# Altium schematic sheet BufferOut.SchDoc: Monitor Outputs Amplification and Buffering
size A; DrawnBy: Enrique Morell; DocumentNumber: 7; Revision: v0.1; SheetNumber: 7; SheetTotal: 9
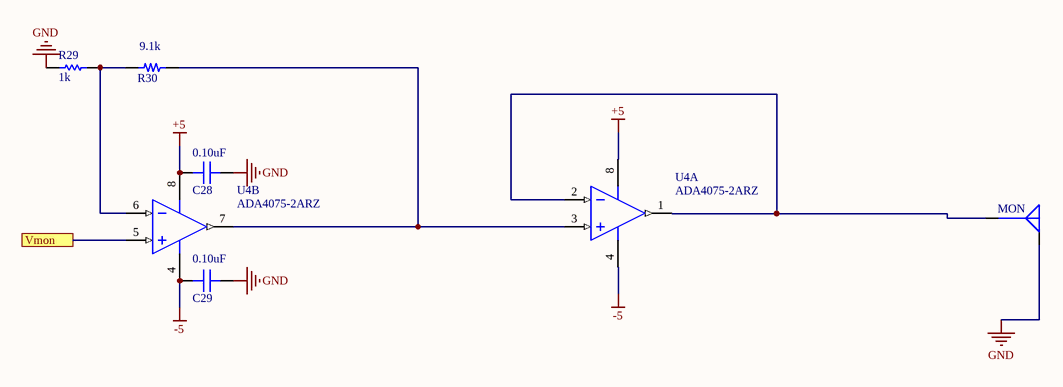
[diagram p0: BufferOut.SchDoc]

## Parts
C28  0.10uF  [CAP 0402/1005]
C29  0.10uF  [CAP 0402/1005]
MON  0731000114  [MOLEX SD-73100-0114]  (value not drawn)
R29  1k  [RESC1005X40X25NL05T05]
R30  9.1k  [RES 0402/1005]
U4  ADA4075-2ARZ  [ADI-R-8_N]  (parts A,B of 2)

## Ports
Vmon

## Nets
+5: C28.2 U4.8(+V)
-5: C29.2 U4.4(-V)
GND: C28.1 C29.1 MON.G R29.1
Vmon: U4.5(+IN_B) ; port Vmon
NetMON_S: MON.S U4.1(OUT_A) U4.2(-IN_A)
NetR29_2: R29.2 R30.1 U4.6(-IN_B)
NetR30_2: R30.2 U4.3(+IN_A) U4.7(OUT_B)

## Library data of the parts
C28 C29 = GRM155R71C104JA88D: CAP CER 0.1UF 16V X7R 0402; Manufacturer: Murata Electronics North America; TemperatureRange: -55C ~ 125C; Tolerance: 5%; Value: 0.10uF; Part Number: GRM155R71C104JA88D; PartId: 12366; Supplier 1: Digi-Key; Supplier Part Number 1: 490-6327-2-ND; ComponentLink1Description: Datasheet; ComponentLink1URL: http://www.murata.com/~/media/webrenewal/support/library/catalog/products/capacitor/mlcc/c02e.pdf; ComponentLink2Description: Digi-Key Listing; ComponentLink2URL: https://www.digikey.com/product-detail/en/murata-electronics-north-america/GRM155R71C104JA88D/490-6327-2-ND/2610891; TemperatureCoefficient: X7R; Voltage: 16V; Price: 0.0046; Device Package: 0402 (1005 Metric)
MON = 0731000114: CONN SMA RCPT R/A 50 OHM PCB; Manufacturer: Molex; Impedance: 50 Ohm; Body Finish: Gold; Body Material: Brass; Contact Termination: Solder; Dielectric Material: Polytetrafluoroethylene (PTFE); Voltage Rating: 500V; Center Contact Material: Gold; Center Contact Plating: Gold; ComponentLink1Description: Datasheet; ComponentLink1URL: https://www.molex.com/pdm_docs/sd/731000114_sd.pdf; ComponentLink2Description: Digi-Key Listing; ComponentLink2URL: https://www.digikey.com/product-detail/en/molex/0731000114/WM5525-ND/1465147; Fastening Type: Threaded; Housing Colour: Gold; Mounting Type: Through Hole, Right Angle; Operating Temperature: -65°C ~ 165°C; PartId: 16436; Part Number: 0731000114; Price: 5.14; Series: 73100; Shield Termination: Solder; Style: SMA; Supplier 1: Digi-Key; Supplier Part Number 1: WM5525-ND; Type: Receptacle, Female Socket
R29 = CMP-2002-00606-3: Chip Resistor, 1 KOhm, +/- 1%, 100 mW, -55 to 155 degC, 0402 (1005 Metric), RoHS, Tape and Reel; PartNumber: ERJ-2RKF1001X; Manufacturer: Basic Passives; Voltage Rating: 50 V; Case\/Package: 0402; Resistance: 1 KOhm; Power Rating: 100 mW; DatasheetVersion: 04/2015; Radiation Hardening: No; Pins: 2; Height: 0.35 mm; RoHSCompliant: true; Case Code (Imperial): 0402; ComponentLink2Description: Datasheet; ComponentLink1Description: Manufacturer URL; PackageReference: 0402; Mount: Surface Mount; Package Quantity: 10000; Tolerance: 1%; ComponentLink1URL: http://www.panasonic.com/; PackageDescription: 2-Pin Surface Mount Device, Body 1 x 0.5 mm; Mounting Technology: Surface Mount; Case Code (Metric): 1005; ComponentLink2URL: http://industrial.panasonic.com/cdbs/www-data/pdf/RDA0000/AOA0000C86.pdf; REACH SVHC: Yes; Packaging: Tape and Reel; Max Operating Temperature: 155 degC; Min Operating Temperature: -55 degC; Width: 0.5 mm; Length: 1 mm
R30 = ERJ-2RKF9101X: RES SMD 9.1K OHM 1% 1/10W 0402; Manufacturer: Panasonic Electronic Components; TemperatureRange: -55C ~ 155C; TemperatureCoefficient: 100ppm/C; PowerRating: 0.1W, 1/10W; Value: 9.1k; Part Number: ERJ-2RKF9101X; PartId: 273; Supplier 1: Digi-Key; Supplier Part Number 1: P9.10KLTR-ND; ComponentLink1Description: Datasheet; ComponentLink1URL: http://industrial.panasonic.com/www-cgi/jvcr13pz.cgi?E+PZ+3+AOA0002+ERJ2RKF9101X+7+WW; ComponentLink2Description: Digikey listing; ComponentLink2URL: http://digikey.com/product-detail/en/ERJ-2RKF9101X/P9.10KLTR-ND/1746291; Tolerance: 1%; Price: 0.0043; Type: Thick Film; Device Package: 0402 (1005 Metric)
U4 = CMP-0384-00855-1: Double Channel Ultra Low Noise Operational Amplifier, 6.5 MHz BW, 12 V/us SR, Industrial, 8-pin SOIC (R-8), Tube; Manufacturer: Analog Devices; V Span Max: 36V; Small Signal Bandwidth: 6.5MHz; Input Bias Current: 30nA; V Span Min: 24V; Amplifiers Per Package: 2; Input Offset Voltage: 300uV; Slew Rate: 12V/us; Iq/Amp: 1.8mA; DatasheetVersion: Rev. B; PackageDescription: 8-Pin Standard Small Outline Package, Body 3.9 x 4.9 mm, Pitch 1.27 mm; Generic Part Number: ADA4075-2; PackageReference: R-8; ComponentLink3URL: http://www.analog.com/static/imported-files/packages/PKG_PDF/SOIC_Narrow%20(R)/R_8.pdf; ComponentLink2URL: http://www.analog.com/static/imported-files/data_sheets/ADA4075-2.pdf; ComponentLink3Description: Package Specification; ComponentLink1Description: Manufacturer URL; PartNumber: ADA4075-2ARZ; PackageVersion: 060506-A; ComponentLink2Description: Datasheet; Code_JEDEC: MS-012-AA; ComponentLink1URL: http://www.analog.com/en/index.html; Mounting Technology: Surface Mount